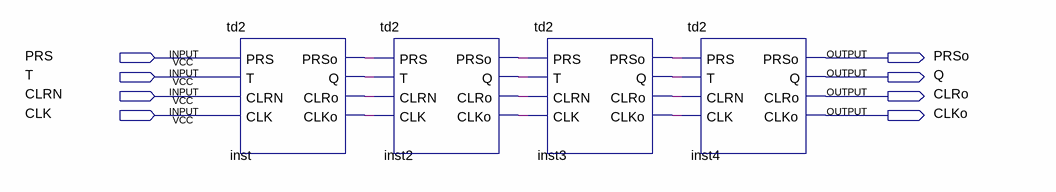
[diagram p0: schematic sheet]
// Quartus schematic td16.bdf as structural Verilog: 4 symbols, 8 pins
module td16 (
  input  PRS,
  input  T,
  input  CLRN,
  input  CLK,
  output PRSo,
  output Q,
  output CLRo,
  output CLKo
);

  wire inst2_clko, inst2_clro, inst2_prso, inst2_q, inst3_clko, inst3_clro, inst3_prso, inst3_q, inst_clko,
       inst_clro, inst_prso, inst_q;

  td2 inst (.PRS(PRS), .T(T), .CLRN(CLRN), .CLK(CLK), .PRSo(inst_prso), .Q(inst_q), .CLRo(inst_clro), .CLKo(inst_clko));
  td2 inst2 (
    .PRS(inst_prso), .T(inst_q), .CLRN(inst_clro), .CLK(inst_clko), .PRSo(inst2_prso), .Q(inst2_q),
    .CLRo(inst2_clro), .CLKo(inst2_clko));
  td2 inst3 (
    .PRS(inst2_prso), .T(inst2_q), .CLRN(inst2_clro), .CLK(inst2_clko), .PRSo(inst3_prso), .Q(inst3_q),
    .CLRo(inst3_clro), .CLKo(inst3_clko));
  td2 inst4 (
    .PRS(inst3_prso), .T(inst3_q), .CLRN(inst3_clro), .CLK(inst3_clko), .PRSo(PRSo), .Q(Q), .CLRo(CLRo),
    .CLKo(CLKo));
endmodule
